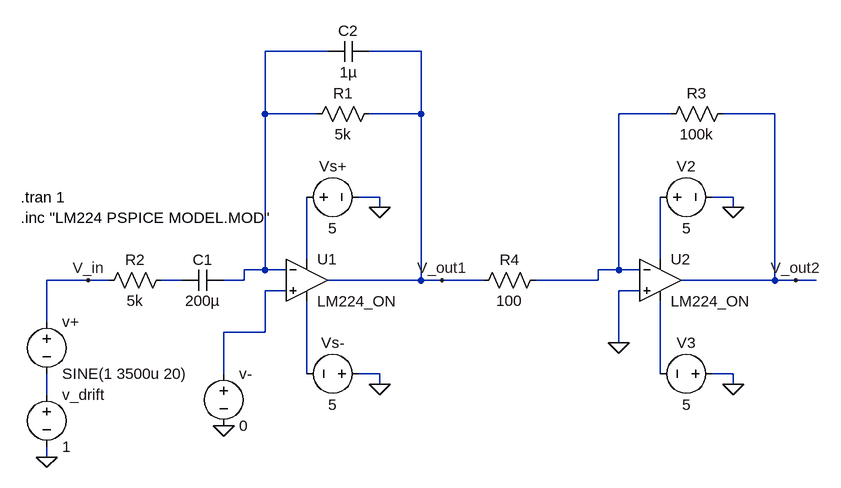
[diagram p0: schematic FilterAmp.asc]
FilterAmp.asc, the LTspice schematic file:
Version 4
SHEET 1 1208 680
WIRE 432 -96 336 -96
WIRE 576 -96 496 -96
WIRE 336 0 336 -96
WIRE 416 0 336 0
WIRE 576 0 576 -96
WIRE 576 0 496 0
WIRE 960 0 880 0
WIRE 1120 0 1040 0
WIRE 512 128 480 128
WIRE 1056 128 1024 128
WIRE 512 144 512 128
WIRE 1056 144 1056 128
WIRE 400 224 400 128
WIRE 944 224 944 128
WIRE 336 240 336 0
WIRE 336 240 304 240
WIRE 368 240 336 240
WIRE 880 240 880 0
WIRE 880 240 848 240
WIRE 912 240 880 240
WIRE 64 256 0 256
WIRE 96 256 64 256
WIRE 208 256 176 256
WIRE 304 256 304 240
WIRE 304 256 272 256
WIRE 576 256 576 0
WIRE 576 256 432 256
WIRE 608 256 576 256
WIRE 672 256 608 256
WIRE 848 256 848 240
WIRE 848 256 752 256
WIRE 1120 256 1120 0
WIRE 1120 256 976 256
WIRE 1152 256 1120 256
WIRE 1184 256 1152 256
WIRE 368 272 336 272
WIRE 912 272 880 272
WIRE 0 320 0 256
WIRE 336 336 336 272
WIRE 336 336 272 336
WIRE 880 352 880 272
WIRE 272 400 272 336
WIRE 400 400 400 288
WIRE 512 400 480 400
WIRE 944 400 944 288
WIRE 1056 400 1024 400
WIRE 512 416 512 400
WIRE 1056 416 1056 400
WIRE 0 432 0 400
WIRE 0 528 0 512
FLAG 512 416 0
FLAG 512 144 0
FLAG 0 528 0
FLAG 608 256 V_out1
FLAG 64 256 V_in
FLAG 1056 416 0
FLAG 1056 144 0
FLAG 880 352 0
FLAG 1152 256 V_out2
FLAG 272 480 0
SYMBOL OpAmps/opamp2 400 192 R0
SYMATTR InstName U1
SYMATTR Value LM224_ON
SYMBOL voltage 384 128 R270
WINDOW 0 32 56 VTop 2
WINDOW 3 -32 56 VBottom 2
SYMATTR InstName Vs+
SYMATTR Value 5
SYMBOL voltage 496 400 R90
WINDOW 0 -32 56 VBottom 2
WINDOW 3 32 56 VTop 2
SYMATTR InstName Vs-
SYMATTR Value 5
SYMBOL voltage 0 304 R0
SYMATTR InstName v+
SYMATTR Value SINE(1 3500u 20)
SYMATTR Value2 AC 1
SYMBOL res 512 -16 R90
WINDOW 0 0 56 VBottom 2
WINDOW 3 32 56 VTop 2
SYMATTR InstName R1
SYMATTR Value 5k
SYMBOL res 192 240 R90
WINDOW 0 0 56 VBottom 2
WINDOW 3 32 56 VTop 2
SYMATTR InstName R2
SYMATTR Value 5k
SYMBOL cap 496 -112 R90
WINDOW 0 0 32 VBottom 2
WINDOW 3 32 32 VTop 2
SYMATTR InstName C2
SYMATTR Value 1µ
SYMBOL cap 272 240 R90
WINDOW 0 0 32 VBottom 2
WINDOW 3 32 32 VTop 2
SYMATTR InstName C1
SYMATTR Value 200µ
SYMBOL OpAmps/opamp2 944 192 R0
SYMATTR InstName U2
SYMATTR Value LM224_ON
SYMBOL voltage 928 128 R270
WINDOW 0 32 56 VTop 2
WINDOW 3 -32 56 VBottom 2
SYMATTR InstName V2
SYMATTR Value 5
SYMBOL voltage 1040 400 R90
WINDOW 0 -32 56 VBottom 2
WINDOW 3 32 56 VTop 2
SYMATTR InstName V3
SYMATTR Value 5
SYMBOL res 1056 -16 R90
WINDOW 0 0 56 VBottom 2
WINDOW 3 32 56 VTop 2
SYMATTR InstName R3
SYMATTR Value 100k
SYMBOL res 768 240 R90
WINDOW 0 0 56 VBottom 2
WINDOW 3 32 56 VTop 2
SYMATTR InstName R4
SYMATTR Value 100
SYMBOL voltage 0 416 R0
SYMATTR InstName v_drift
SYMATTR Value 1
SYMBOL voltage 272 384 R0
SYMATTR InstName v-
SYMATTR Value 0
TEXT -40 160 Left 2 !.inc "LM224 PSPICE MODEL.MOD"
TEXT -40 128 Left 2 !.tran 1

The netlist it stands for:
* FilterAmp.asc
XU1 N006 N001 N003 N007 V_out1 LM224_ON  ; pins In+ In- V+ V- OUT
Vs+ N003 0 5
Vs- 0 N007 5
v+ V_in N009 SINE(1 3500u 20) AC 1
R1 V_out1 N001 5k
R2 N005 V_in 5k
C2 V_out1 N001 1µ
C1 N001 N005 200µ
XU2 0 N002 N004 N008 V_out2 LM224_ON  ; pins In+ In- V+ V- OUT
V2 N004 0 5
V3 0 N008 5
R3 V_out2 N002 100k
R4 N002 V_out1 100
v_drift N009 0 1
v- N006 0 0
.inc "LM224 PSPICE MODEL.MOD"
.tran 1
.backanno
.end